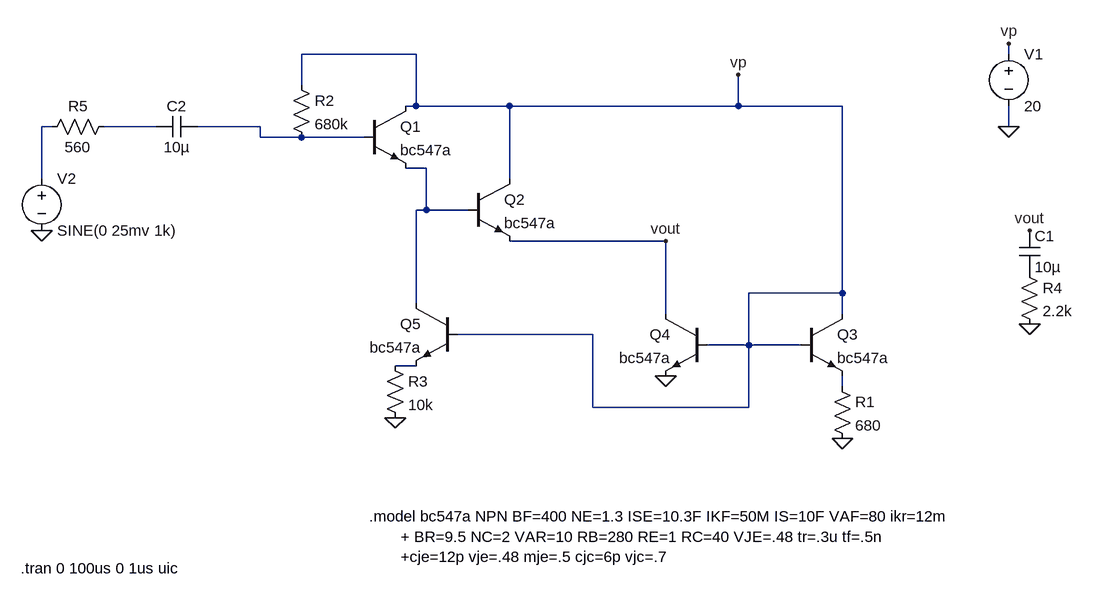
[diagram p0: schematic darlington_mejorado.asc]
darlington_mejorado.asc, the LTspice schematic file:
Version 4
SHEET 1 2328 680
WIRE 64 -464 -112 -464
WIRE 976 -464 976 -480
WIRE -112 -416 -112 -464
WIRE 64 -384 64 -464
WIRE 64 -384 48 -384
WIRE 208 -384 64 -384
WIRE 560 -384 560 -432
WIRE 560 -384 208 -384
WIRE 720 -384 560 -384
WIRE -496 -352 -512 -352
WIRE -336 -352 -416 -352
WIRE -176 -352 -272 -352
WIRE 976 -352 976 -384
WIRE -176 -336 -176 -352
WIRE -112 -336 -176 -336
WIRE -16 -336 -112 -336
WIRE 80 -288 48 -288
WIRE -512 -272 -512 -352
WIRE 208 -272 208 -384
WIRE 80 -224 80 -288
WIRE 80 -224 64 -224
WIRE 144 -224 80 -224
WIRE 448 -176 208 -176
WIRE 720 -96 720 -384
WIRE 720 -96 576 -96
WIRE 64 -80 64 -224
WIRE 448 -64 448 -176
WIRE 720 -64 720 -96
WIRE 336 -32 128 -32
WIRE 576 -16 576 -96
WIRE 576 -16 512 -16
WIRE 656 -16 576 -16
WIRE 64 16 32 16
WIRE 720 48 720 32
WIRE 336 80 336 -32
WIRE 576 80 576 -16
WIRE 576 80 336 80
FLAG 448 32 0
FLAG 720 128 0
FLAG 32 96 0
FLAG 976 -352 0
FLAG 976 -480 vp
FLAG 560 -432 vp
FLAG 1008 -48 0
FLAG 448 -176 vout
FLAG 1008 -192 vout
FLAG -512 -192 0
SYMBOL npn -16 -384 R0
SYMATTR InstName Q1
SYMATTR Value bc547a
SYMBOL npn 144 -272 R0
SYMATTR InstName Q2
SYMATTR Value bc547a
SYMBOL npn 656 -64 R0
SYMATTR InstName Q3
SYMATTR Value bc547a
SYMBOL npn 512 -64 M0
SYMATTR InstName Q4
SYMATTR Value bc547a
SYMBOL npn 128 -80 M0
SYMATTR InstName Q5
SYMATTR Value bc547a
SYMBOL res 704 32 R0
SYMATTR InstName R1
SYMATTR Value 680
SYMBOL res -128 -432 R0
SYMATTR InstName R2
SYMATTR Value 680k
SYMBOL res 16 0 R0
SYMATTR InstName R3
SYMATTR Value 10k
SYMBOL voltage 976 -480 R0
WINDOW 123 0 0 Left 2
WINDOW 39 0 0 Left 2
SYMATTR InstName V1
SYMATTR Value 20
SYMBOL res 992 -144 R0
SYMATTR InstName R4
SYMATTR Value 2.2k
SYMBOL cap 992 -192 R0
SYMATTR InstName C1
SYMATTR Value 10µ
SYMBOL res -400 -368 R90
WINDOW 0 0 56 VBottom 2
WINDOW 3 32 56 VTop 2
SYMATTR InstName R5
SYMATTR Value 560
SYMBOL cap -272 -368 R90
WINDOW 0 0 32 VBottom 2
WINDOW 3 32 32 VTop 2
SYMATTR InstName C2
SYMATTR Value 10µ
SYMBOL voltage -512 -288 R0
WINDOW 123 0 0 Left 2
WINDOW 39 0 0 Left 2
SYMATTR InstName V2
SYMATTR Value SINE(0 25mv 1k)
TEXT -8 248 Left 2 !.model bc547a NPN BF=400 NE=1.3 ISE=10.3F IKF=50M IS=10F VAF=80 ikr=12m\n       + BR=9.5 NC=2 VAR=10 RB=280 RE=1 RC=40 VJE=.48 tr=.3u tf=.5n\n       +cje=12p vje=.48 mje=.5 cjc=6p vjc=.7
TEXT -544 328 Left 2 !.tran 0 100us 0 1us uic

The netlist it stands for:
* darlington_mejorado.asc
Q1 vp N003 N004 0 bc547a
Q2 vp N004 vout 0 bc547a
Q3 vp vp N006 0 bc547a
Q4 vout vp 0 0 bc547a
Q5 N004 vp N005 0 bc547a
R1 N006 0 680
R2 vp N003 680k
R3 N005 0 10k
V1 vp 0 20
R4 P001 0 2.2k
C1 vout P001 10µ
R5 N002 N001 560
C2 N003 N002 10µ
V2 N001 0 SINE(0 25mv 1k)
.model NPN NPN
.model PNP PNP
.lib standard.bjt
.model bc547a NPN BF=400 NE=1.3 ISE=10.3F IKF=50M IS=10F VAF=80 ikr=12m
       + BR=9.5 NC=2 VAR=10 RB=280 RE=1 RC=40 VJE=.48 tr=.3u tf=.5n
       +cje=12p vje=.48 mje=.5 cjc=6p vjc=.7
.tran 0 100us 0 1us uic
.backanno
.end